# Altium schematic sheet Sheet1.SchDoc
size A3
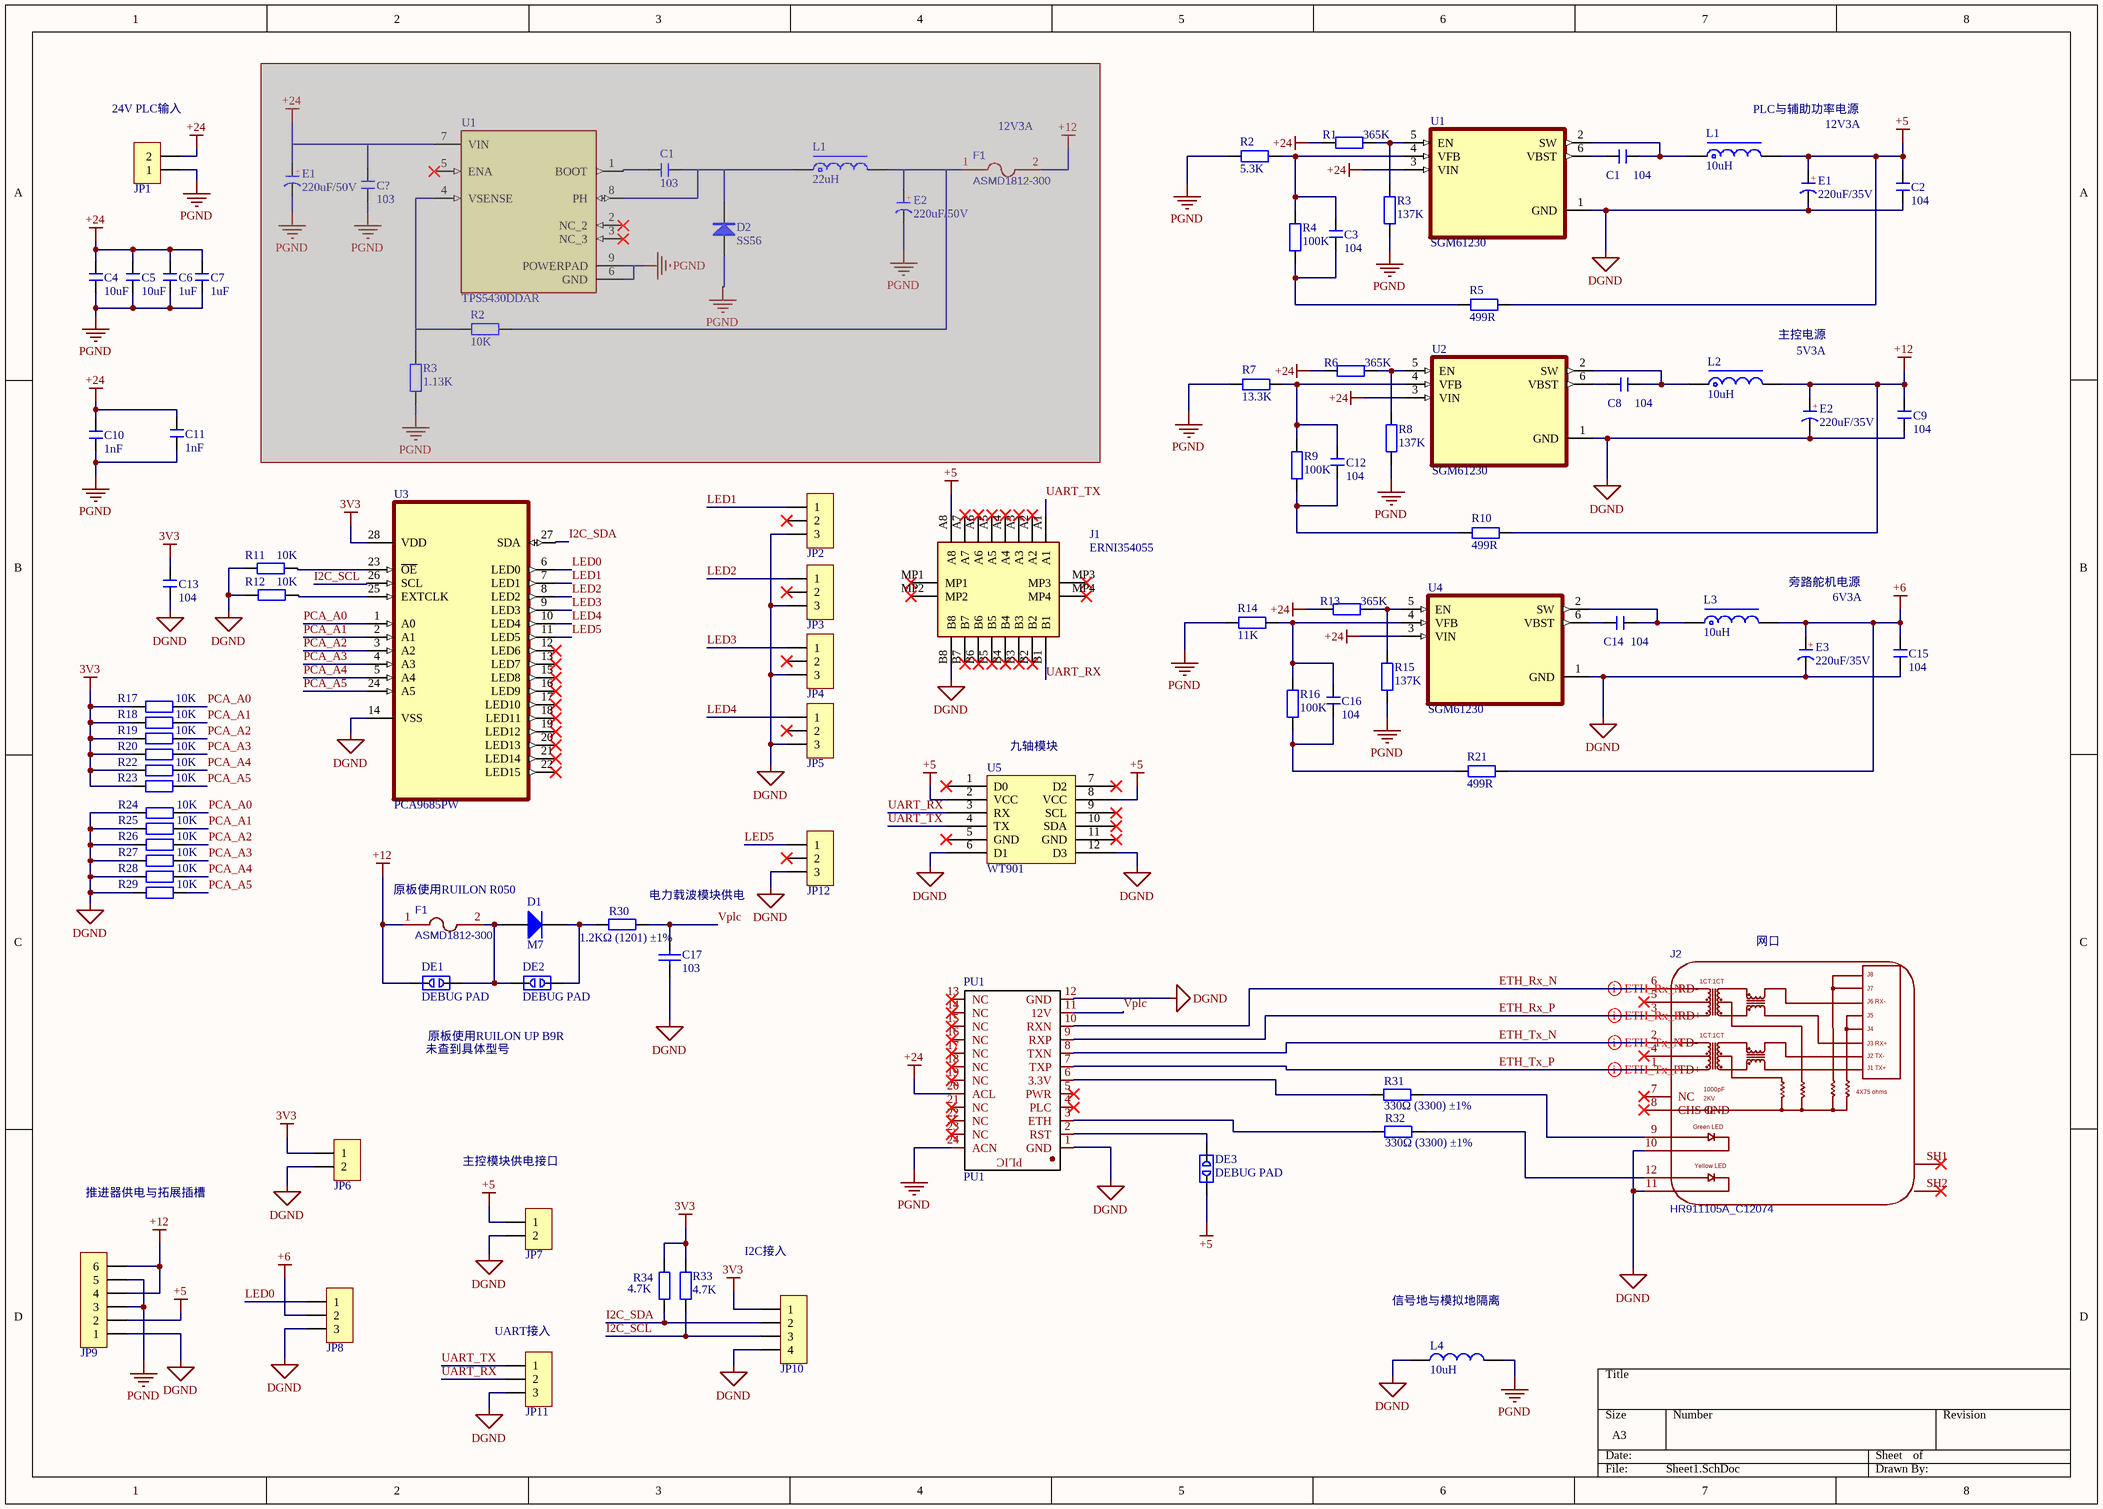
[diagram p0: Sheet1.SchDoc]

## Parts
(Parts that share a designator on the sheet are numbered #1, #2 ... from top to bottom, then left to right.)
C1#1  104  [C 0603_L]
C1#2  103  [C 0603_L]  (masked out: inside a compile mask, not in the netlist)
C2  104  [C 0603_L]
C3  104  [C 0603_L]
C4  10uF  [C 1206_L]
C5  10uF  [C 1206_L]
C6  1uF  [C 0805_L]
C7  1uF  [C 0805_L]
C8  104  [C 0603_L]
C9  104  [C 0603_L]
C10  1nF  [C 0603_L]
C11  1nF  [C 0603_L]
C12  104  [C 0603_L]
C13  104  [C 0603_L]
C14  104  [C 0603_L]
C15  104  [C 0603_L]
C16  104  [C 0603_L]
C17  103  [0603_C]
C?  103  [C 1210_L]  (masked out: inside a compile mask, not in the netlist)
D1  M7  [SMA(DO-214AC)_S1]
D2  SS56  [SMC]  (masked out: inside a compile mask, not in the netlist)
DE1  DEBUG PAD  [DEBUG_A]
DE2  DEBUG PAD  [DEBUG_A]
DE3  DEBUG PAD  [DEBUG_A]
E1#1  220uF/50V  [CM G(12.5*13.5)]  (masked out: inside a compile mask, not in the netlist)
E1#2  220uF/35V  [CM E(8*10.2)]
E2#1  220uF/50V  [CM G(12.5*13.5)]  (masked out: inside a compile mask, not in the netlist)
E2#2  220uF/35V  [CM E(8*10.2)]
E3  220uF/35V  [CM E(8*10.2)]
F1#1  ASMD1812-300  [FUSE]  (masked out: inside a compile mask, not in the netlist)
F1#2  ASMD1812-300  [FUSE]
J1  ERNI354055  [354055]
J2  HR911105A_C12074  [RJ45]
JP1  HDR-1X2  [KF128-5.08-2P]  (value not drawn)
JP2  HDR-1X3  [HDR2.54-LI-3P]  (value not drawn)
JP3  HDR-1X3  [HDR2.54-LI-3P]  (value not drawn)
JP4  HDR-1X3  [HDR2.54-LI-3P]  (value not drawn)
JP5  HDR-1X3  [HDR2.54-LI-3P]  (value not drawn)
JP6  HDR-1X2  [HDR2.54-WS-2P]  (value not drawn)
JP7  HDR-1X2  [HDR2.54-WS-2P]  (value not drawn)
JP8  HDR-1X3  [HDR2.54-LI-3P]  (value not drawn)
JP9  HDR-1X6  [KF128-5.08-6P]  (value not drawn)
JP10  HDR-1X4  [MX 1.25-WS-4P]  (value not drawn)
JP11  HDR-1X3  [HDR2.54-WS-3P]  (value not drawn)
JP12  HDR-1X3  [HDR2.54-LI-3P]  (value not drawn)
L1#1  10uH  [CD75]
L1#2  22uH  [CDRH127]  (masked out: inside a compile mask, not in the netlist)
L2  10uH  [CD75]
L3  10uH  [CD75]
L4  10uH  [L 0805]
PU1  PU1  [LW-MPA223A]
R1  365K  [R 0402_L]
R2#1  5.3K  [R 0603_L]
R2#2  10K  [R 0603_L]  (masked out: inside a compile mask, not in the netlist)
R3#1  137K  [R 0402_L]
R3#2  1.13K  [R 0603_L]  (masked out: inside a compile mask, not in the netlist)
R4  100K  [R 0603_L]
R5  499R  [R 0603_L]
R6  365K  [R 0402_L]
R7  13.3K  [R 0603_L]
R8  137K  [R 0402_L]
R9  100K  [R 0603_L]
R10  499R  [R 0603_L]
R11  10K  [R 0603_L]
R12  10K  [R 0603_L]
R13  365K  [R 0402_L]
R14  11K  [R 0603_L]
R15  137K  [R 0402_L]
R16  100K  [R 0603_L]
R17  10K  [R 0603_L]
R18  10K  [R 0603_L]
R19  10K  [R 0603_L]
R20  10K  [R 0603_L]
R21  499R  [R 0603_L]
R22  10K  [R 0603_L]
R23  10K  [R 0603_L]
R24  10K  [R 0603_L]
R25  10K  [R 0603_L]
R26  10K  [R 0603_L]
R27  10K  [R 0603_L]
R28  10K  [R 0603_L]
R29  10K  [R 0603_L]
R30  1.2KΩ (1201) ±1%  [0603_R]
R31  330Ω (3300) ±1%  [0603_R]
R32  330Ω (3300) ±1%  [0603_R]
R33  4.7K  [R 0603_L]
R34  4.7K  [R 0603_L]
U1#1  SGM61230  [SOT23-6]
U1#2  TPS5430DDAR  [TPS5430DDAR]  (masked out: inside a compile mask, not in the netlist)
U2  SGM61230  [SOT23-6]
U3  PCA9685PW  [SOP65P640X110-28N]
U4  SGM61230  [SOT23-6]
U5  WT901  [WT901]

## Nets
3V3: C13.1 JP6.1 JP10.1 R17.1 R18.1 R19.1 R20.1 R22.1 R23.1 R33.1 R34.1 U3.28(VDD)
+5: C2.2 DE3.1 E1#2.1(A) J1.A8 JP7.1 JP9.2 L1#1.2 R5.1 U5.2(VCC) U5.8(VCC)
+6: C15.2 E3.1(A) JP8.2 L3.2 R21.1
+12: C9.2 DE1.2 E2#2.1(A) F1#2.1 JP9.4 JP9.6 L2.2 R10.1
+24: C4.1 C5.1 C6.1 C7.1 C10.1 C11.1 JP1.2 PU1.20(ACL) R1.2 R6.2 R13.2 U1#1.3(VIN) U2.3(VIN) U4.3(VIN)
DGND: C2.1 C9.1 C13.2 C15.1 C17.1 E1#2.2(K) E2#2.2(K) E3.2(K) J1.B8 J2.10 J2.11 JP2.3 JP3.3 JP4.3 JP5.3 JP6.2 JP7.2 JP8.3 JP9.1 JP10.4 JP11.3 JP12.3 L4.1 PU1.1(GND) PU1.12(GND) R11.1 R12.1 R24.1 R25.1 R26.1 R27.1 R28.1 R29.1 U1#1.1(GND) U2.1(GND) U3.14(VSS) U4.1(GND) U5.6(D1) U5.12(D3)
PGND: C4.2 C5.2 C6.2 C7.2 C10.2 C11.2 JP1.1 JP9.3 JP9.5 L4.2 PU1.24(ACN) R2#1.2 R3#1.2 R7.2 R8.2 R14.2 R15.2
ETH_Rx_N: J2.6(RD-) PU1.10(RXN)
ETH_Rx_P: J2.3(RD+) PU1.9(RXP)
ETH_Tx_N: J2.2(TD-) PU1.8(TXN)
ETH_Tx_P: J2.1(TD+) PU1.7(TXP)
I2C_SCL: JP10.3 R33.2 U3.26(SCL)
I2C_SDA: JP10.2 R34.2 U3.27(SDA)
LED0: JP8.1 U3.6(LED0)
LED1: JP2.1 U3.7(LED1)
LED2: JP3.1 U3.8(LED2)
LED3: JP4.1 U3.9(LED3)
LED4: JP5.1 U3.10(LED4)
LED5: JP12.1 U3.11(LED5)
PCA_A0: R17.2 R24.2 U3.1(A0)
PCA_A1: R18.2 R25.2 U3.2(A1)
PCA_A2: R19.2 R26.2 U3.3(A2)
PCA_A3: R20.2 R27.2 U3.4(A3)
PCA_A4: R22.2 R28.2 U3.5(A4)
PCA_A5: R23.2 R29.2 U3.24(A5)
UART_RX: J1.B1 JP11.2 U5.3(RX)
UART_TX: J1.A1 JP11.1 U5.4(TX)
Vplc: C17.2 PU1.11(12V) R30.2
NetC1#1_1: C1#1.1 U1#1.6(VBST)
NetC1#1_2: C1#1.2 L1#1.1 U1#1.2(SW)
NetC3_1: C3.1 R2#1.1 R4.2 U1#1.4(VFB)
NetC3_2: C3.2 R4.1 R5.2
NetC8_1: C8.1 U2.6(VBST)
NetC8_2: C8.2 L2.1 U2.2(SW)
NetC12_1: C12.1 R7.1 R9.2 U2.4(VFB)
NetC12_2: C12.2 R9.1 R10.2
NetC14_1: C14.1 U4.6(VBST)
NetC14_2: C14.2 L3.1 U4.2(SW)
NetC16_1: C16.1 R14.1 R16.2 U4.4(VFB)
NetC16_2: C16.2 R16.1 R21.2
NetD1_1: D1.1(A) DE1.1 DE2.2 F1#2.2
NetD1_2: D1.2(K) DE2.1 R30.1
NetDE3_2: DE3.2 PU1.2(RST)
NetJ2_9: J2.9 R31.2
NetJ2_12: J2.12 R32.2
NetPU1_3: PU1.3(ETH) R32.1
NetPU1_6: PU1.6(3.3V) R31.1
NetR1_1: R1.1 R3#1.1 U1#1.5(EN)
NetR6_1: R6.1 R8.1 U2.5(EN)
NetR11_2: R11.2 U3.23(~{OE})
NetR12_2: R12.2 U3.25(EXTCLK)
NetR13_1: R13.1 R15.1 U4.5(EN)

Not connected (* = marked no-connect by the designer): J1 A2* A3* A4* A5* A6* A7* B2* B3* B4* B5* B6* B7* MP1* MP2* MP3* MP4*; J2 4* 5* 7(NC)* 8(CHS_GND)* SH1* SH2*; JP2 2*; JP3 2*; JP4 2*; JP5 2*; JP12 2*; PU1 4(PLC)* 5(PWR)* 13(NC)* 14(NC)* 15(NC)* 16(NC)* 17(NC)* 18(NC)* 19(NC)* 21(NC)* 22(NC)* 23(NC)*; U3 12(LED6)* 13(LED7)* 15(LED8)* 16(LED9)* 17(LED10)* 18(LED11)* 19(LED12)* 20(LED13)* 21(LED14)* 22(LED15)*; U5 1(D0)* 5(GND)* 7(D2)* 9(SCL)* 10(SDA)* 11(GND)*

## Layout directives
differential pair: ETH_Rx_N, ETH_Rx_P, ETH_Tx_N, ETH_Tx_P

## Notes on the sheet
- (near JP1) 24V PLC输入
- (near L1#1) PLC与辅助功率电源
- (near F1#1) 12V3A
- 12V3A
- 主控电源
- 5V3A
- 旁路舵机电源
- 6V3A
- (near U5) 九轴模块
- (near F1#2) 原板使用RUILON R050
- (near R30) 电力载波模块供电
- (near J2) 网口
- 未查到具体型号
- 原板使用RUILON UP B9R
- 主控模块供电接口
- 推进器供电与拓展插槽
- I2C接入
- (near L4) 信号地与模拟地隔离
- (near JP11) UART接入
- (in symbol C-CM) +
- (in symbol HR911105A_C12074) J8; 1CT:1CT; J7; J6 RX-; J5; J4; J3 RX+; J2 TX-; J1 TX+; 1000pF; 4X75 ohms; 2KV; Green LED; Yellow LED
- (in symbol LW-MPA223A) PLIC

## Library data of the parts
C1#1 C1#2 C2-C16 C? = C: 无极性贴片电容; 版权归属: 源创客; BOM名称: 无极性贴片电容; 学习资源: www.ooocke.com
C17 = 0603 12pF (120) 5% 50V: 贴片电容; ComponentLink1Description: 供应商链接; ComponentLink1URL: http://www.szlcsc.com/product/details_39506.html; Package: 0603; Supplier: LC; SuppliersPartNumber: C38523
D1 = SMA(DO-214AC) M7: 二极管; Notepad: 1N4007 4007 编号C2464 已经停售, 使用新物料编号C95872; ComponentLink1Description: 供应商链接; ComponentLink1URL: http://www.szlcsc.com/product/details_2841.html; Package: SMA(DO-214AC); Supplier: LC; SuppliersPartNumber: C95872
D2 = SS34: 肖特基二极管; 版权归属: 源创客; 属性: 40V/3A; BOM名称: 肖特基二极管; 学习资源: www.ooocke.com
DE1-DE3 = DEBUG: 调试断点焊盘; 版权归属: 源创客; BOM名称: 调试断点焊盘; 学习资源: www.ooocke.com
E1#1 E1#2 E2#1 E2#2 E3 = C-CM: 贴片电解电容; 版权归属: 源创客; BOM名称: 贴片电解电容; 学习资源: www.ooocke.com
F1#1 F1#2 = ASMD1812-300: BOM_Manufacturer: JDTFUSE; Contributor: LCSC; BOM_Paste Type: recommend; BOM_Assembly Type: smtWeld; BOM_Supplier: LCSC; BOM_Manufacturer Part: ASMD1812-300; BOM_Supplier Part: C135366; spicePre: F; spiceSymbolName: ASMD1812-300
J1 = 354055: SMC Female Connector 16-pin, vertical, SMT; Manufacturer_Name: ERNI; Geometry.Height: 6.55mm; Manufacturer_Part_Number: 354055; Mouser Part Number: 305-354055; Mouser Price/Stock: https://www.mouser.co.uk/ProductDetail/ERNI/354055?qs=5HRuLjoIg%2FHZR%252BxuQao%2FQQ%3D%3D; Arrow Part Number: *; Arrow Price/Stock: *; Datasheet Link: https://www.erni.com/fileadmin/import/products/assets/DC0006573.PDF
J2 = HR911105A_C12074: BOM_Manufacturer: HANRUN; BOM_Paste Type: expand; BOM_Assembly Type: manualWeld; BOM_Supplier: LCSC; BOM_Manufacturer Part: HR911105A; image: //image.lceda.cn/szlcsc/C12074.jpg; BOM_Supplier Part: C12074; spicePre: J; spiceSymbolName: HR911105A_C12074
JP1 JP6 JP7 = Header 2: 2P接插件; 版权归属: 源创客; BOM名称: 2P接插件; 学习资源: www.ooocke.com
JP2-JP5 JP8 JP11 JP12 = Header 3: 3P接插件; 版权归属: 源创客; BOM名称: 3P接插件; 学习资源: www.ooocke.com
JP9 = Header 6: 6P接插件; 版权归属: 源创客; BOM名称: 6P接插件; 学习资源: www.ooocke.com
JP10 = Header 4: 4P接插件; 版权归属: 源创客; BOM名称: 4P接插件; 学习资源: www.ooocke.com
L1#1 L2 L3 = L-CD: 贴片功率电感; BOM名称: 功率电感; 版权归属: 源创客; 学习资源: www.ooocke.com
L1#2 = L-CDRH: 功率屏蔽电感; 版权归属: 源创客; BOM名称: 功率屏蔽电感; 学习资源: www.ooocke.com
L4 = L: 小功率贴片电感; 版权归属: 源创客; BOM名称: 小功率贴片电感; 学习资源: www.ooocke.com
PU1 = LW-MPA223A
R1 R2#1 R2#2 R3#1 R3#2 R4-R29 R33 R34 = R: 贴片电阻; 版权归属: 源创客; BOM名称: 贴片电阻; 学习资源: www.ooocke.com
R30 = 0603 1.2KΩ (1201) 1%: 贴片电阻; ComponentLink1Description: 供应商链接; ComponentLink1URL: http://www.szlcsc.com/product/details_23492.html; Package: 0603; Supplier: LC; SuppliersPartNumber: C22765
R31 R32 = 0603 330Ω (3300) 1%: 贴片电阻; ComponentLink1Description: 供应商链接; ComponentLink1URL: http://www.szlcsc.com/product/details_23865.html; Package: 0603; Supplier: LC; SuppliersPartNumber: C23138
U1#1 U2 U4 = SGM61230: TPS565208国产替代; MP: TPS565208DDCR; MF: Texas Instruments; SnapEDA_Link: https://www.snapeda.com/parts/TPS565208DDCR/Texas%20Instruments/view-part/1474263/?ref=snap; Digi-Key_Part_Number: 296-48755-1-ND; Value: *; Check_prices: https://www.snapeda.com/parts/TPS565208DDCR/Texas%20Instruments/view-part/1474263/?ref=eda; Package: SOT-23-THN-6 Texas Instruments; Purchase-URL: https://pricing.snapeda.com/search/part/TPS565208DDCR/?ref=eda
U1#2 = TPS5430DDAR: 5.5V to 36V Input, 3A, 500kHz Step-Down Converter 8-SO PowerPAD -40 to 125; MF: Texas Instruments; Texas_Instruments-Purchase-URL: https://snapeda.com/shop?store=Texas+Instruments&id=423058; Value: *; Arrow_Electronics-Purchase-URL: https://snapeda.com/shop?store=Arrow+Electronics&id=423058; MP: TPS5430DDAR; DigiKey-Purchase-URL: https://snapeda.com/shop?store=DigiKey&id=423058; Package: HSOIC-8 Texas Instruments; SnapEDA_Link: https://www.snapeda.com/parts/TPS5430DDAR/Texas%20Instruments/view-part/423058/?ref=snap; Mouser-Purchase-URL: https://snapeda.com/shop?store=Mouser&id=423058; Digi-Key_Part_Number: 296-26988-1-ND
U3 = PCA9685PW: LED Driver IC 16 Output Linear PWM Dimming 25mA 28-TSSOP; MF: NXP USA; MP: PCA9685PW,112; Purchase-URL: https://pricing.snapeda.com/search/part/PCA9685PW,112/?ref=eda; Value: *; Package: TSSOP-28 NXP Semiconductors; Digi-Key_Part_Number: 568-8366-5-ND; SnapEDA_Link: https://www.snapeda.com/parts/PCA9685PW,112/NXP%20USA%20Inc./view-part/550390/?ref=snap; Check_prices: https://www.snapeda.com/parts/PCA9685PW,112/NXP%20USA%20Inc./view-part/550390/?ref=eda
U5 = WT901: 维特智能WT901九轴模块